# EAGLE schematic NintendoNinjaSchematic (EAGLE 6.3)
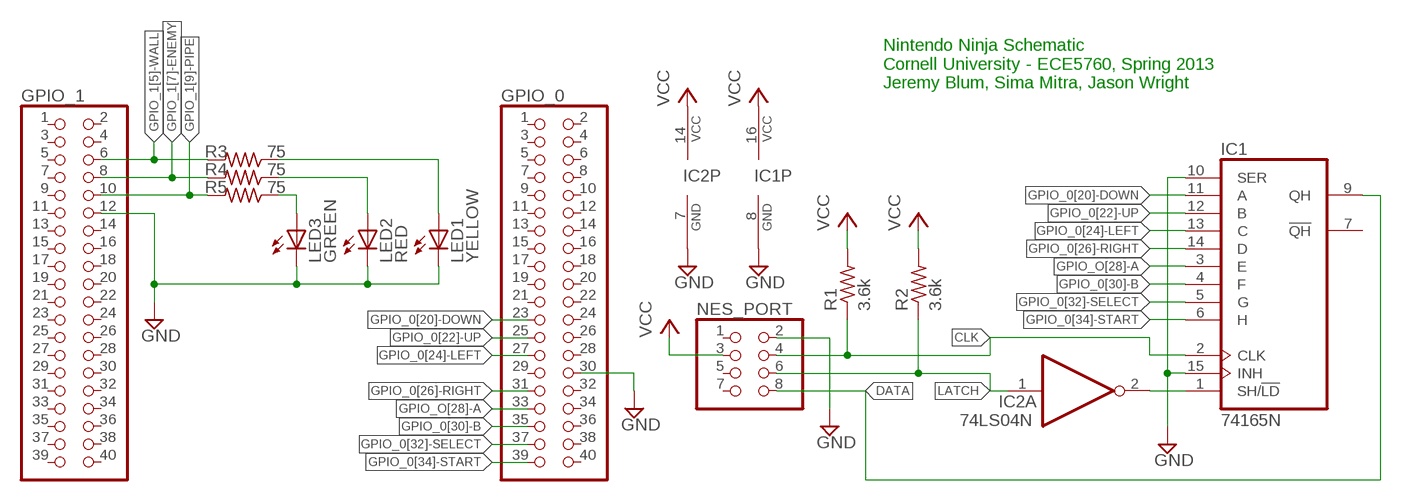
[diagram p0: schematic, sheet 1]

## Parts
GPIO_0  PINHD-2X20  [2X20]
GPIO_1  PINHD-2X20  [2X20]
IC1  74165N  [DIL16]
IC2  74LS04N  [DIL14]
LED1  YELLOW  LED5MM  [LED5MM]
LED2  RED  LED5MM  [LED5MM]
LED3  GREEN  LED5MM  [LED5MM]
NES_PORT  PINHD-2X4  [2X04]
R1  3.6k  R-US_V526-0  [V526-0]
R2  3.6k  R-US_V526-0  [V526-0]
R3  75  R-US_V526-0  [V526-0]
R4  75  R-US_V526-0  [V526-0]
R5  75  R-US_V526-0  [V526-0]

## Nets
CLK: IC1.2(CLK) NES_PORT.4 R1.1
DATA: IC1.9(QH) NES_PORT.8
GND: GPIO_0.30 GPIO_1.12 IC1.8(GND) IC1.10(SER) IC1.15(INH) IC2.7(P:GND) LED1.K(C) LED2.K(C) LED3.K(C) NES_PORT.2
GPIO_0[20]-DOWN: GPIO_0.23 IC1.11(A)
GPIO_0[22]-UP: GPIO_0.25 IC1.12(B)
GPIO_0[24]-LEFT: GPIO_0.27 IC1.13(C)
GPIO_0[26]-RIGHT: GPIO_0.31 IC1.14(D)
GPIO_0[30]-B: GPIO_0.35 IC1.4(F)
GPIO_0[32]-SELECT: GPIO_0.37 IC1.5(G)
GPIO_0[34]-START: GPIO_0.39 IC1.6(H)
GPIO_1[5]-WALL: GPIO_1.6 R3.2
GPIO_1[7]-ENEMY: GPIO_1.8 R4.2
GPIO_1[9]-PIPE: GPIO_1.10 R5.2
GPIO_O[28]-A: GPIO_0.33 IC1.3(E)
LATCH: IC2.1(A:I) NES_PORT.6 R2.1
N$1: LED3.A R5.1
N$2: LED2.A R4.1
N$3: LED1.A R3.1
N$6: IC1.1(SH/!LD) IC2.2(A:O)
VCC: IC1.16(VCC) IC2.14(P:VCC) NES_PORT.3 R1.2 R2.2
Unconnected: GPIO_0.1 GPIO_0.2 GPIO_0.3 GPIO_0.4 GPIO_0.5 GPIO_0.6 GPIO_0.7 GPIO_0.8 GPIO_0.9 GPIO_0.10 GPIO_0.11 GPIO_0.12 GPIO_0.13 GPIO_0.14 GPIO_0.15 GPIO_0.16 GPIO_0.17 GPIO_0.18 GPIO_0.19 GPIO_0.20 GPIO_0.21 GPIO_0.22 GPIO_0.24 GPIO_0.26 GPIO_0.28 GPIO_0.29 GPIO_0.32 GPIO_0.34 GPIO_0.36 GPIO_0.38 GPIO_0.40 GPIO_1.1 GPIO_1.2 GPIO_1.3 GPIO_1.4 GPIO_1.5 GPIO_1.7 GPIO_1.9 GPIO_1.11 GPIO_1.13 GPIO_1.14 GPIO_1.15 GPIO_1.16 GPIO_1.17 GPIO_1.18 GPIO_1.19 GPIO_1.20 GPIO_1.21 GPIO_1.22 GPIO_1.23 GPIO_1.24 GPIO_1.25 GPIO_1.26 GPIO_1.27 GPIO_1.28 GPIO_1.29 GPIO_1.30 GPIO_1.31 GPIO_1.32 GPIO_1.33 GPIO_1.34 GPIO_1.35 GPIO_1.36 GPIO_1.37 GPIO_1.38 GPIO_1.39 GPIO_1.40 IC1.7(!QH) IC2.3(B:I) IC2.4(B:O) IC2.5(C:I) IC2.6(C:O) IC2.8(D:O) IC2.9(D:I) IC2.10(E:O) IC2.11(E:I) IC2.12(F:O) IC2.13(F:I) NES_PORT.1 NES_PORT.5 NES_PORT.7

## Notes on the sheet
- Nintendo Ninja Schematic
  Cornell University - ECE5760, Spring 2013
  Jeremy Blum, Sima Mitra, Jason Wright

## Library data of the parts
GPIO_0 GPIO_1 = pinhead:PINHD-2X20: PIN HEADER
IC1 = 74xx-us:74*165: 8-bit parallel load SHIFT REGISTER
IC2 = 74xx-us:74*04: Hex INVERTER
LED1-LED3 = adafruit:LED: LED OSRAM: - CHIPLED LG R971, LG N971, LY N971, LG Q971, LY Q971, LO R971, LY R971 LH N974, LH R974 LS Q976, LO Q976, LY Q976 LO Q996 - Hyper CHIPLED LW Q18S LB Q993, LB Q99A, LB R99A - SideLED LS A670, LO A670, LY A670, LG A670, LP A670 LB A673, LV A673, LT A673, LW A673 LH A674 LY A675 LS A676, LA A676, LO A676, LY A676, LW A676 LS A679, LY A679, LG A679 - Hyper Micro SIDELED® LS Y876, LA Y876, LO Y876, LY Y876 LT Y87S - SmartLED LW L88C, LW L88S LB L89C, LB L89S, LG L890 LS L89K, LO L89K, LY L89K LS L896, LA L896, LO L896, LY L896 - TOPLED LS T670, LO T670, LY T670, LG T670, LP T670 LSG T670, LSP T670, LSY T670, LOP T670, LYG T670 LG T671, LOG T671, LSG T671 LB T673, LV T673, LT T673, LW T673 LH T674 LS T676, LA T676, LO T676, LY T676, LB T676, LH T676, LSB T676, LW T676 LB T67C, LV T67C, LT T67C, LS T67K, LO T67K, LY T67K, LW E67C LS E67B, LA E67B, LO E67B, LY E67B, LB E67C, LV E67C, LT E67C LW T67C LS T679, LY T679, LG T679 LS T770, LO T770, LY T770, LG T770, LP T770 LB T773, LV T773, LT T773, LW T773 LH T774 LS E675, LA E675, LY E675, LS T675 LS T776, LA T776, LO T776, LY T776, LB T776 LHGB T686 LT T68C, LB T68C - Hyper Mini TOPLED® LB M676 - Mini TOPLED Santana® LG M470 LS M47K, LO M47K, LY M47K Source: http://www.osram.convergy.de/
NES_PORT = pinhead:PINHD-2X4: PIN HEADER
R1-R5 = rcl:R-US_: RESISTOR, American symbol